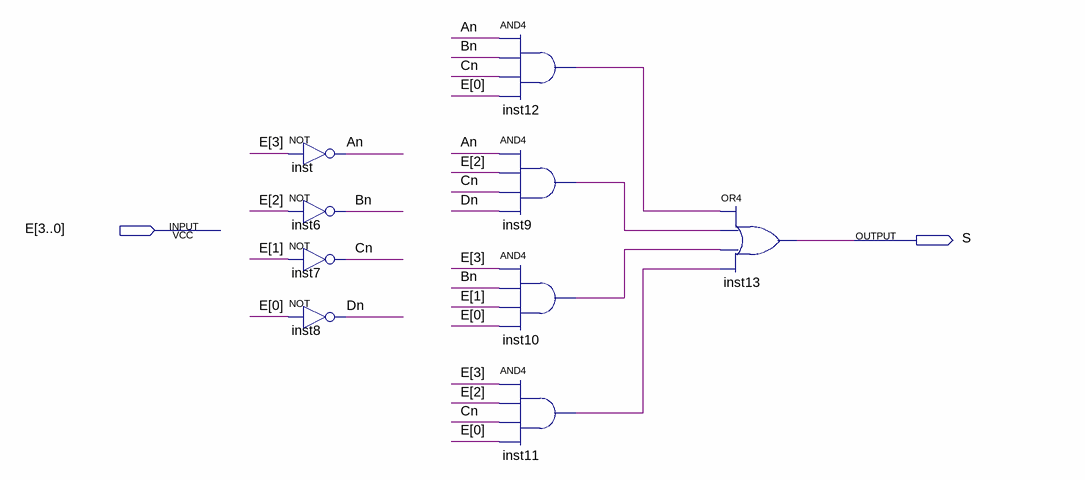
[diagram p0: schematic sheet]
// Quartus schematic BCD_A.bdf as structural Verilog: 9 symbols, 2 pins
module BCD_A (
  input  [3:0] E,
  output S
);

  wire An, Bn, Cn, Dn, inst9_out, inst10_out, inst11_out, inst12_out;

  not inst (An, E[3]);
  not inst6 (Bn, E[2]);
  not inst7 (Cn, E[1]);
  not inst8 (Dn, E[0]);
  and inst12 (inst12_out, An, Bn, Cn, E[0]);
  and inst9 (inst9_out, An, E[2], Cn, Dn);
  and inst10 (inst10_out, E[3], Bn, E[1], E[0]);
  and inst11 (inst11_out, E[3], E[2], Cn, E[0]);
  or inst13 (S, inst12_out, inst9_out, inst10_out, inst11_out);
endmodule
